# EAGLE design RECEIVER (EAGLE 7.5.0)
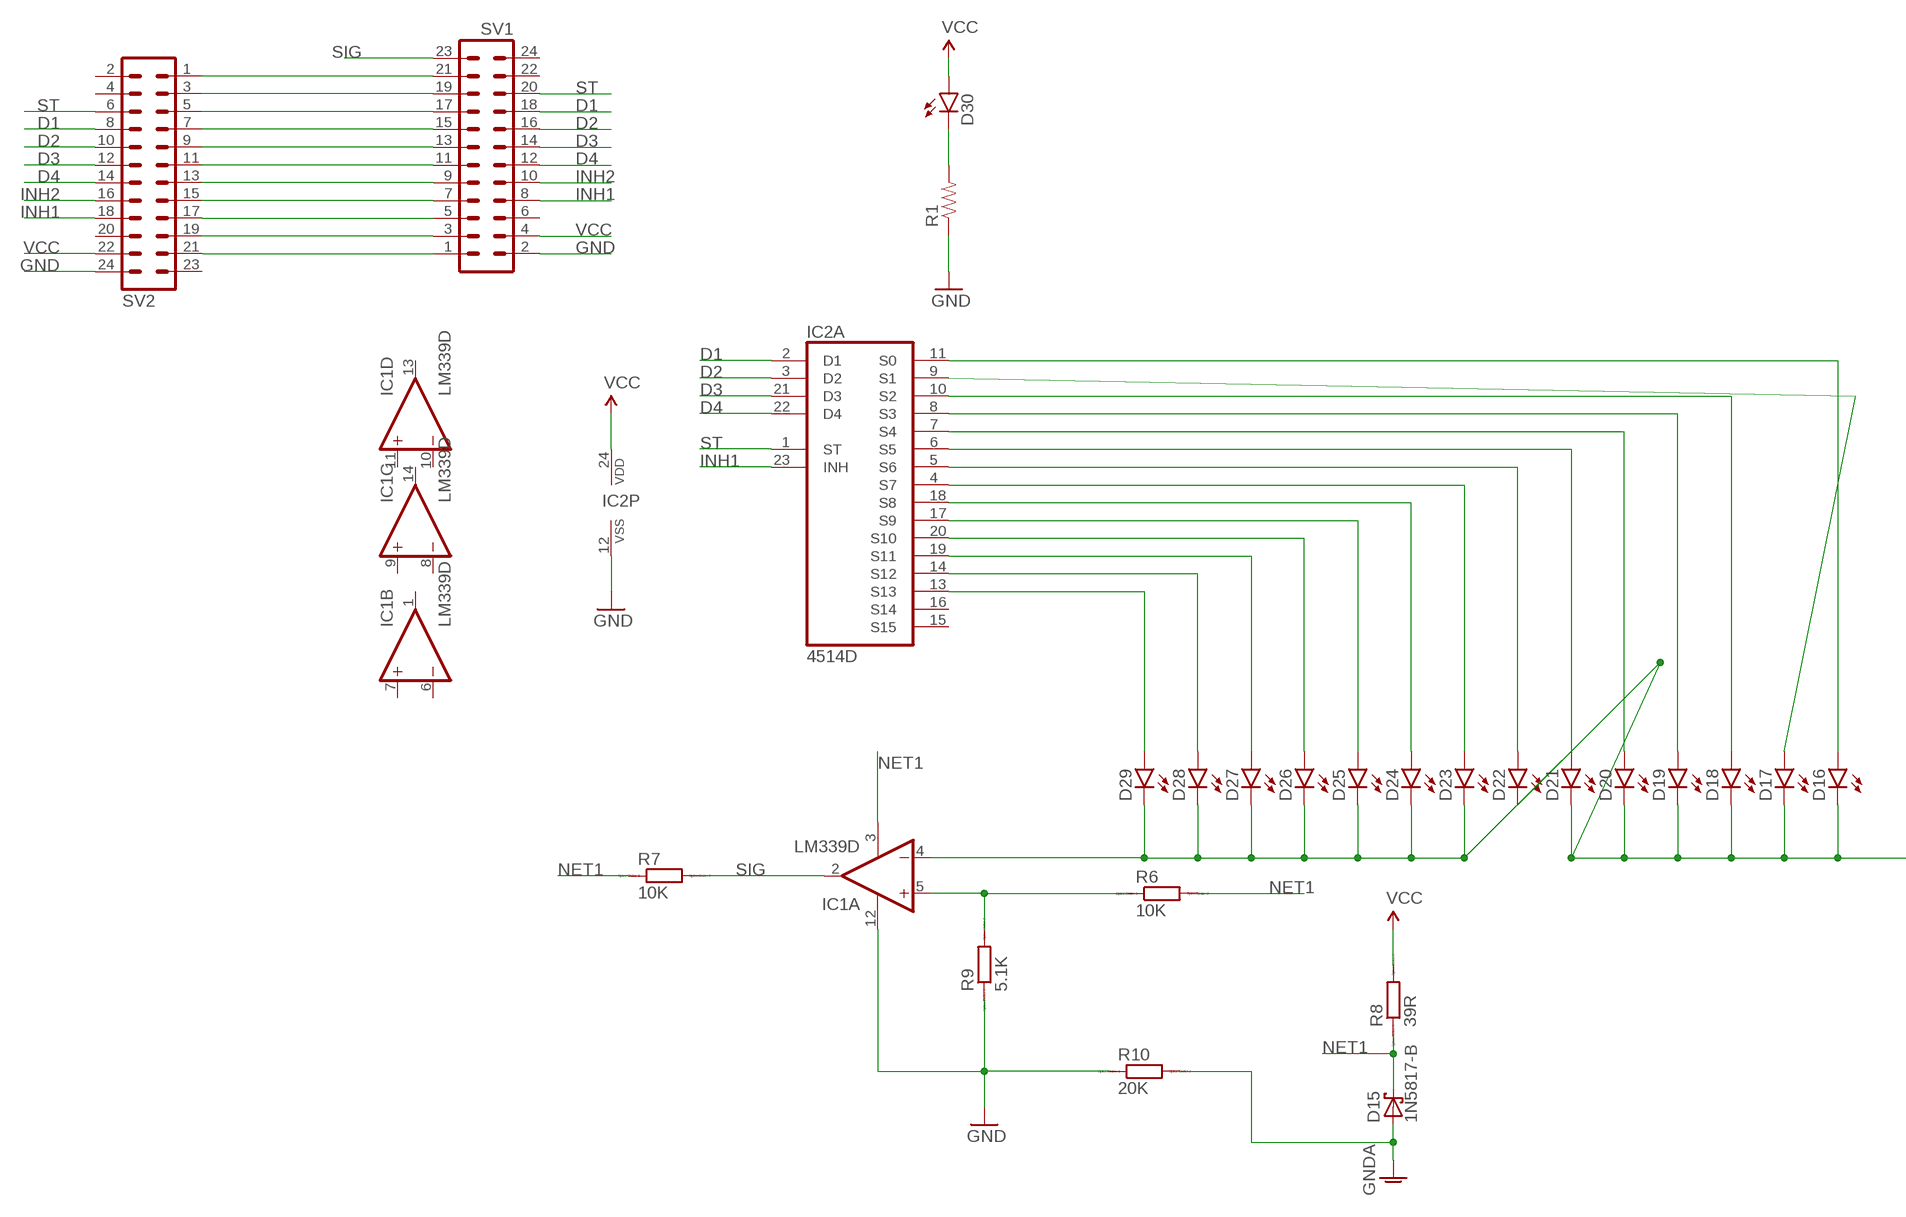
[diagram p0: schematic, sheet 1, part 1 of 2]
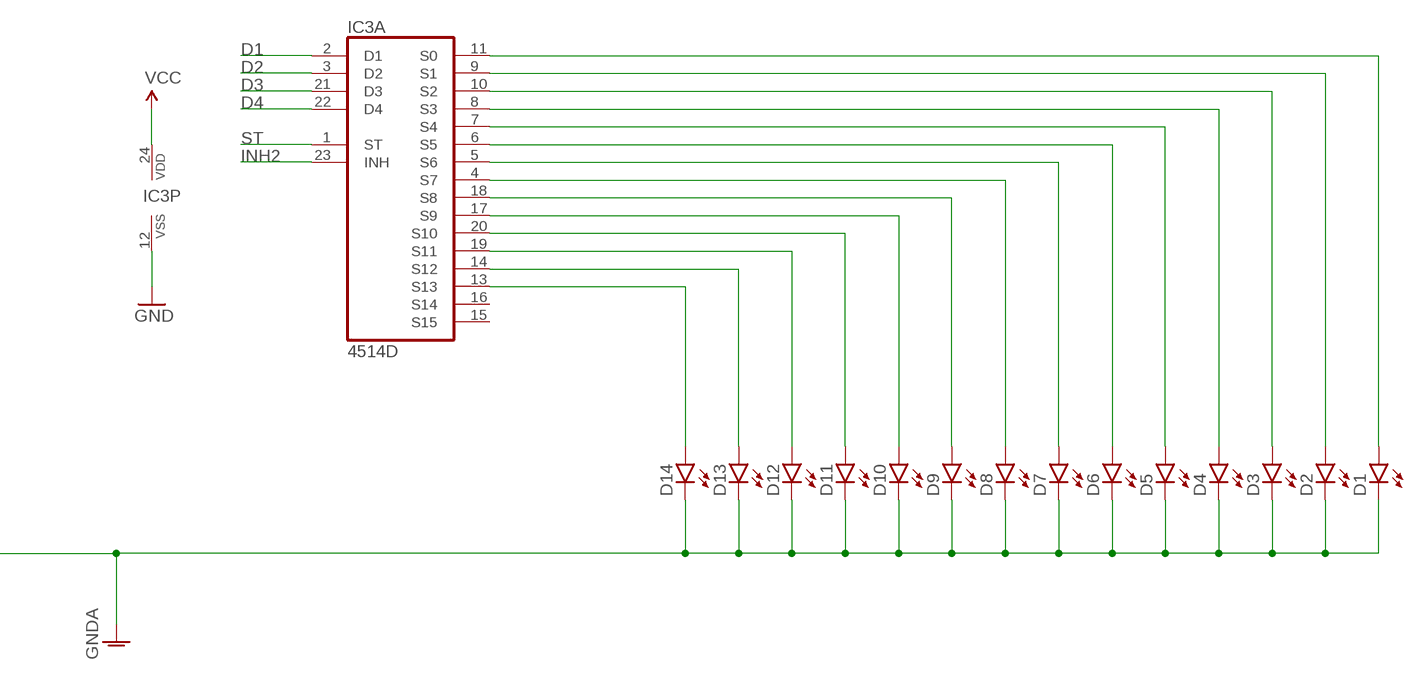
[diagram p1: schematic, sheet 1, part 2 of 2]

## Parts
D1  LED5MM  [LED5MM]
D2  LED5MM  [LED5MM]
D3  LED5MM  [LED5MM]
D4  LED5MM  [LED5MM]
D5  LED5MM  [LED5MM]
D6  LED5MM  [LED5MM]
D7  LED5MM  [LED5MM]
D8  LED5MM  [LED5MM]
D9  LED5MM  [LED5MM]
D10  LED5MM  [LED5MM]
D11  LED5MM  [LED5MM]
D12  LED5MM  [LED5MM]
D13  LED5MM  [LED5MM]
D14  LED5MM  [LED5MM]
D15  1N5817-B  [DO41-7.6]
D16  LED5MM  [LED5MM]
D17  LED5MM  [LED5MM]
D18  LED5MM  [LED5MM]
D19  LED5MM  [LED5MM]
D20  LED5MM  [LED5MM]
D21  LED5MM  [LED5MM]
D22  LED5MM  [LED5MM]
D23  LED5MM  [LED5MM]
D24  LED5MM  [LED5MM]
D25  LED5MM  [LED5MM]
D26  LED5MM  [LED5MM]
D27  LED5MM  [LED5MM]
D28  LED5MM  [LED5MM]
D29  LED5MM  [LED5MM]
D30  LED1206  [LED-1206]
IC1  LM339D  [SO14]
IC2  4514D  [SO24W]
IC3  4514D  [SO24W]
R1  RESISTOR1206  [1206]
R6  10K  R0207/10  [0207/10]
R7  10K  R0207/10  [0207/10]
R8  39R  R0207/10  [0207/10]
R9  5.1K  R0207/10  [0207/10]
R10  20K  R0207/10  [0207/10]
SV1  MA12-2W  [MA12-2W]
SV2  MA12-2W  [MA12-2W]

## Nets
D1: IC2.2(A:D1) IC3.2(A:D1) SV1.18 SV2.8
D2: IC2.3(A:D2) IC3.3(A:D2) SV1.16 SV2.10
D3: IC2.21(A:D3) IC3.21(A:D3) SV1.14 SV2.12
D4: IC2.22(A:D4) IC3.22(A:D4) SV1.12 SV2.14
GND: IC1.12(P:GND) IC2.12(P:VSS) IC3.12(P:VSS) R1.1 R9.1 R10.1 SV1.2 SV2.24
GNDA: D1.K(C) D2.K(C) D3.K(C) D4.K(C) D5.K(C) D6.K(C) D7.K(C) D8.K(C) D9.K(C) D10.K(C) D11.K(C) D12.K(C) D13.K(C) D14.K(C) D15.A D16.K(C) D17.K(C) D18.K(C) D19.K(C) D20.K(C) D21.K(C) D22.K(C) D23.K(C) D24.K(C) D25.K(C) D26.K(C) D27.K(C) D28.K(C) D29.K(C) IC1.4(A:-IN) R10.2
INH1: IC2.23(A:INH) SV1.8 SV2.18
INH2: IC3.23(A:INH) SV1.10 SV2.16
N$1: D16.A IC2.11(A:S0)
N$2: D17.A IC2.9(A:S1)
N$3: D18.A IC2.10(A:S2)
N$4: D19.A IC2.8(A:S3)
N$5: D20.A IC2.7(A:S4)
N$6: D21.A IC2.6(A:S5)
N$7: D22.A IC2.5(A:S6)
N$8: D23.A IC2.4(A:S7)
N$9: D24.A IC2.18(A:S8)
N$10: D25.A IC2.17(A:S9)
N$11: D26.A IC2.20(A:S10)
N$12: D27.A IC2.19(A:S11)
N$13: D28.A IC2.14(A:S12)
N$14: D29.A IC2.13(A:S13)
N$15: SV1.7 SV2.15
N$16: IC1.5(A:+IN) R6.1 R9.2
N$17: SV1.21 SV2.1
N$18: SV1.19 SV2.3
N$19: SV1.17 SV2.5
N$20: SV1.15 SV2.7
N$21: SV1.13 SV2.9
N$22: SV1.11 SV2.11
N$23: SV1.9 SV2.13
N$24: D1.A IC3.11(A:S0)
N$25: D2.A IC3.9(A:S1)
N$26: D3.A IC3.10(A:S2)
N$27: D4.A IC3.8(A:S3)
N$28: D5.A IC3.7(A:S4)
N$29: D6.A IC3.6(A:S5)
N$30: D7.A IC3.5(A:S6)
N$31: D8.A IC3.4(A:S7)
N$32: D9.A IC3.18(A:S8)
N$33: D10.A IC3.17(A:S9)
N$34: D11.A IC3.20(A:S10)
N$35: D12.A IC3.19(A:S11)
N$36: D13.A IC3.14(A:S12)
N$37: D14.A IC3.13(A:S13)
N$38: SV1.5 SV2.17
N$39: SV1.3 SV2.19
N$40: SV1.1 SV2.21
N$41: D30.C R1.2
NET1: D15.C IC1.3(P:V+) R6.2 R7.1 R8.1
SIG: IC1.2(A:OUT) R7.2 SV1.23
ST: IC2.1(A:ST) IC3.1(A:ST) SV1.20 SV2.6
VCC: D30.A IC2.24(P:VDD) IC3.24(P:VDD) R8.2 SV1.4 SV2.22
Unconnected: IC1.1(B:OUT) IC1.6(B:-IN) IC1.7(B:+IN) IC1.8(C:-IN) IC1.9(C:+IN) IC1.10(D:-IN) IC1.11(D:+IN) IC1.13(D:OUT) IC1.14(C:OUT) IC2.15(A:S15) IC2.16(A:S14) IC3.15(A:S15) IC3.16(A:S14) SV1.6 SV1.22 SV1.24 SV2.2 SV2.4 SV2.20 SV2.23

## Library data of the parts
D1-D14 D16-D30 = SparkFun-LED:LED: LEDs Standard schematic elements and footprints for 5mm, 3mm, 1206, and 0603 sized LEDs. 5mm - Spark Fun Electronics SKU : COM-00529 (and others)
D15 = diode:1N581*: 1.0A SCHOTTKY BARRIER RECTIFIER Source: http://www.diodes.com/datasheets/ds23001.pdf
IC1 = linear:LM339: Low Power Low Offset Voltage Quad Comparators with open collector; LM139/LM239/LM339/LM2901/LM3302
IC2 IC3 = 45xx:4514: 4-bit latch 4-16 line DECODER
R1 = SparkFun-Passives:RESISTOR: Resistor Basic schematic elements and footprints for 0603, 1206, and PTH resistors.
R6-R10 = eagle-ltspice:R: RESISTOR, European symbol; SPICEMODEL: NONE; SPICEPREFIX: R
SV1 SV2 = con-lstb:MA12-2W: PIN HEADER; OC_FARNELL: unknown; OC_NEWARK: unknown

## Board
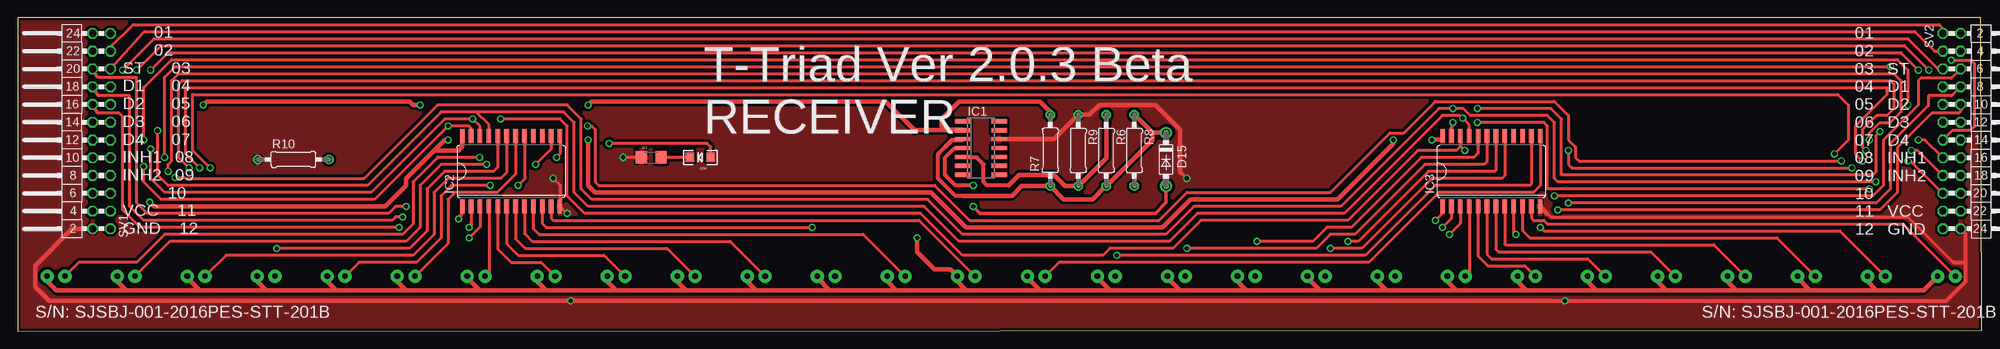
[diagram p2: board, top side]
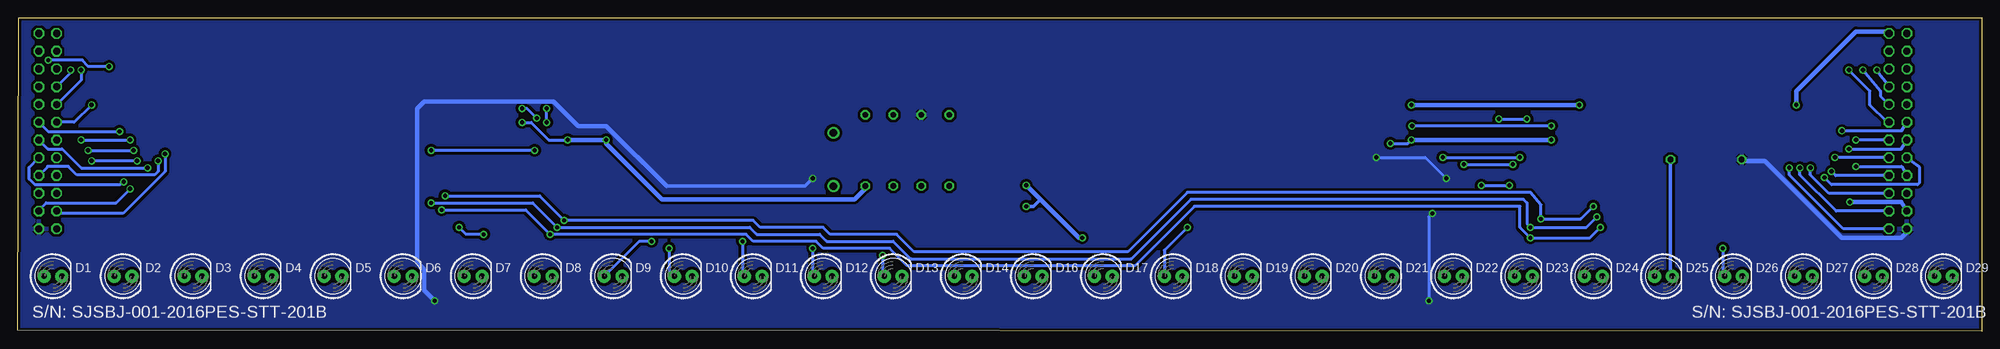
[diagram p3: board, bottom side, seen from below]

Size 280.57 x 44.85 mm. Coordinates in mm from the lower left corner, seen from the top.
Outline: 0.05,0 280.57,0.1 280.42,44.85 0,44.85 0.05,0
Copper layers (1*16): Top 0.035mm / dielectric 1.5mm / Bottom 0.035mm
Design rules "default": minimum track width 5mil, minimum drill 15mil, track to track 7mil, track to pad 7mil, pad to pad 7mil, via to via 7mil, smd to smd 6mil, copper to edge 15mil, drill to drill 8mil, minimum pad ring 10mil, minimum via ring 8mil, stop-mask expansion 4mil, vias tented up to drill 0mil, thermal gap 10mil

### Footprints (pad centres in the part's own frame; a part is rotated, then mirrored left to right if it is on the bottom)
LED5MM = drill 0.813 pad 1.88: A -1.27,0; K 1.27,0
DO41-7.6 = drill 1.1 pad 1.7: A 3.81,0; C -3.81,0
LED-1206 = smd 1.2 x 1.4: A -1.5,0; C 1.5,0
SO14 = smd 0.6 x 2.2: 1 -3.81,-2.6; 2 -2.54,-2.6; 3 -1.27,-2.6; 4 0,-2.6; 5 1.27,-2.6; 6 2.54,-2.6; 7 3.81,-2.6; 8 3.81,2.6; 9 2.54,2.6; 10 1.27,2.6; 11 0,2.6; 12 -1.27,2.6; 13 -2.54,2.6; 14 -3.81,2.6
SO24W = smd 0.66 x 2.032: 1 -6.985,-5.029; 2 -5.715,-5.029; 3 -4.445,-5.029; 4 -3.175,-5.029; 5 -1.905,-5.029; 6 -0.635,-5.029; 7 0.635,-5.029; 8 1.905,-5.029; 9 3.175,-5.029; 10 4.445,-5.029; 11 5.715,-5.029; 12 6.985,-5.029; 13 6.985,5.029; 14 5.715,5.029; 15 4.445,5.029; 16 3.175,5.029; 17 1.905,5.029; 18 0.635,5.029; 19 -0.635,5.029; 20 -1.905,5.029; 21 -3.175,5.029; 22 -4.445,5.029; 23 -5.715,5.029; 24 -6.985,5.029
1206 = smd 1.6 x 1.8: 1 -1.4,0; 2 1.4,0
0207/10 = drill 0.813 octagon: 1 -5.08,0; 2 5.08,0
MA12-2W = drill 1.016 octagon: 1 -13.97,-1.27; 2 -13.97,1.27; 3 -11.43,-1.27; 4 -11.43,1.27; 5 -8.89,-1.27; 6 -8.89,1.27; 7 -6.35,-1.27; 8 -6.35,1.27; 9 -3.81,-1.27; 10 -3.81,1.27; 11 -1.27,-1.27; 12 -1.27,1.27; 13 1.27,-1.27; 14 1.27,1.27; 15 3.81,-1.27; 16 3.81,1.27; 17 6.35,-1.27; 18 6.35,1.27; 19 8.89,-1.27; 20 8.89,1.27; 21 11.43,-1.27; 22 11.43,1.27; 23 13.97,-1.27; 24 13.97,1.27

### Placement (x,y rotation side)
D1  275.5,7.85 0 bottom
D2  265.5,7.85 0 bottom
D3  255.5,7.85 0 bottom
D4  245.5,7.85 0 bottom
D5  235.5,7.85 0 bottom
D6  225.5,7.85 0 bottom
D7  215.5,7.85 0 bottom
D8  205.5,7.85 0 bottom
D9  195.5,7.85 0 bottom
D10  185.5,7.85 0 bottom
D11  175.5,7.85 0 bottom
D12  165.5,7.85 0 bottom
D13  155.5,7.85 0 bottom
D14  145.5,7.85 0 bottom
D15  164.05,24.55 270 top
D16  135.5,7.85 0 bottom
D17  125.5,7.85 0 bottom
D18  115.5,7.85 0 bottom
D19  105.5,7.85 0 bottom
D20  95.5,7.85 0 bottom
D21  85.5,7.85 0 bottom
D22  75.5,7.85 0 bottom
D23  65.5,7.85 0 bottom
D24  55.5,7.85 0 bottom
D25  45.5,7.85 0 bottom
D26  35.5,7.85 0 bottom
D27  25.5,7.85 0 bottom
D28  15.5,7.85 0 bottom
D29  5.5,7.85 0 bottom
D30  97.5,24.85 180 top
IC1  137.61,26.18 270 top
IC2  70.5,22.85 0 top
IC3  210.5,22.85 0 top
R1  90.5,24.85 0 top
R6  155.5,25.85 270 top
R7  147.5,25.85 90 top
R8  159.5,25.85 270 top
R9  151.5,25.85 270 top
R10  39.4,24.55 0 top
SV1  12,28.6 90 top
SV2  276.25,28.6 270 top

### Tracks (layer width: path | path; a pad name or v marks a point on that pad's centre or on a via)
D1  (via drill 0.6)
  Top 0.406: IC2.2 64.78,15.13 v64.5,14.85 | v55,16.35 54,16.35 53.5,15.85 18,15.85 16,17.85 16,33.65 11.53,33.65 SV1.18 | IC3.2 204.78,16.14 v203.5,14.85 | SV2.8 276.22,33.65 272.9,33.65 272.9,32.25 267.5,26.85 267.5,20.35 265.5,18.35 v221.5,18.35
  Bottom 0.406: v55,16.35 56.5,14.85 v64.5,14.85 65,15.35 65,18.35 65.5,18.85 113,18.85 121.5,10.35 153,10.35 155.5,12.85 165,12.85 166,13.85 175,13.85 176,14.85 v203.5,14.85 207,18.35 v221.5,18.35
D2  (via drill 0.6)
  Top 0.406: IC2.3 66.06,14.9 v64.5,13.35 | v54.5,14.85 17.5,14.85 15,17.35 15,30.65 14.5,31.15 11.49,31.15 SV1.16 | IC3.3 206.06,15.4 v204.5,13.85 | SV2.10 277.52,31.47 277.2,31.15 273.4,31.15 268.5,26.25 268.5,19.85 266,17.35 v220,17.35
  Bottom 0.406: v54.5,14.85 56,13.35 v64.5,13.35 66,14.85 66,17.85 112.5,17.85 121,9.35 153.5,9.35 156,11.85 165.5,11.85 166.5,12.85 175.5,12.85 176.5,13.85 v204.5,13.85 208,17.35 v220,17.35
D3  (via drill 0.6)
  Top 0.406: IC2.21 67.33,29.53 65.5,31.35 | 65.5,31.35 60.5,31.35 50,20.85 21.5,20.85 20,22.35 v20,28.65 | IC3.21 207.32,29.53 v206.4,30.45 206,30.85 203.5,30.85 189.5,16.85 168.5,16.85 164.5,12.85 134.5,12.85 129.5,17.85 81.5,17.85 79.5,19.85 79.5,29.85 78,31.35 65.5,31.35 | v208.5,31.85 219,31.85 220.5,30.35 220.5,22.35 265,22.35 265.5,22.85 265.5,28.05 v266,28.55
  Bottom 0.406: v20,28.65 11.45,28.65 SV1.14 | SV2.12 276.2,28.55 v266,28.55 | v206.4,30.45 207.8,31.85 v208.5,31.85
D4  (via drill 0.6)
  Top 0.406: IC2.22 66.06,29.3 v65,30.35 61,30.35 50.5,19.85 21,19.85 19,21.85 v19,26.05 | v69,30.35 77.5,30.35 78.5,29.35 78.5,19.35 81,16.85 129,16.85 135,10.85 155,10.85 156,11.85 165,11.85 169,15.85 190,15.85 200,25.85 205.5,25.85 206.06,26.41 IC3.22 206.06,26.5 v206.7,25.85 | v221.5,25.85 221.5,23.85 222,23.35 v262,23.35
  Bottom 0.406: v19,26.05 11.51,26.05 SV1.12 | v69,30.35 v65,30.35 | v206.7,25.85 v221.5,25.85 | SV2.14 276.24,26.05 274.2,26.05 271.5,23.35 v262,23.35
GND  (via drill 0.6)
  Top 0.406: 218.46,16.85 218.5,16.85 219,16.35 270,16.35 276.5,9.85 | 278.25,7.1 276,4.85 | v78.5,16.85 78.46,16.85 IC2.12 77.48,20.87 v76.5,21.85 | R1.1 v86.5,24.85
  Top 0.5: v167,21.85 166,22.85
  Top 0.6: 219,4.35 275.5,4.35 278.25,7.1 278.25,9.85 | 278.25,9.85 278.25,13.9 SV2.24 | 276.5,9.85 278.25,9.85
  Top 0.61: SV1.2 7.78,14.63 2.5,9.35 2.5,6.35 4.5,4.35 v79,4.35 219,4.35 | 218.46,16.85 IC3.12 | 166,22.69 166,22.85 166,28.85 162.5,32.35 154.5,32.35 153.08,30.93 R9.1 148.02,27.45 IC1.12
  Bottom 0.406: v78.5,16.85 79,16.35 v79,4.35 | v86.5,24.85 79.5,24.85 v76.5,21.85
  Bottom 0.5: 187.89,20.74 168.11,20.74 v167,21.85
  Bottom 0.61: SV1.2 10.23,14.62 11.5,13.35 20,13.35 31,24.35 34.12,24.35 R10.1 | 187.89,20.74 196.5,29.35 200.5,29.35 204,32.85 222.5,32.85 223.5,31.85 223.5,9.85 222.5,8.85 222.5,5.85 v221,4.35
  pour Top (isolate 0.406): 0,44.85 280.5,44.85 280.5,-0.15 0,-0.15
  pour Bottom (isolate 0.406): 0,-0.15 280.5,-0.15 280.5,44.85 0,44.85
GNDA  (via drill 0.6)
  Top 0.5: D15.A 164.05,18.4 162.5,16.85 137.5,16.85 v136.5,17.85
  Top 0.6: v136.5,20.85 134,20.85 132.5,22.35 132.5,24.85 133.83,26.18 IC1.4
  Top 0.61: D29.K 4.23,7.12 5.5,5.85 15.5,5.85 | 15.5,5.85 26,5.85 | 26,5.85 35.5,5.85 | 35.5,5.85 45.5,5.85 | 45.5,5.85 55.5,5.85 | 55.5,5.85 66,5.85 | 66,5.85 75.5,5.85 | 75.5,5.85 85.5,5.85 | 85.5,5.85 95.5,5.85 | 95.5,5.85 105.5,5.85 | 105.5,5.85 116,5.85 | 116,5.85 125.5,5.85 | 125.5,5.85 135.5,5.85 | 135.5,5.85 146,5.85 | 146,5.85 156,5.85 | 156,5.85 166,5.85 | 166,5.85 175.5,5.85 | 175.5,5.85 186,5.85 | 186,5.85 195.5,5.85 | 195.5,5.85 205.5,5.85 | 205.5,5.85 215.5,5.85 | 215.5,5.85 225.5,5.85 | 225.5,5.85 235.5,5.85 | 235.5,5.85 245.5,5.85 | 245.5,5.85 256,5.85 | 256,5.85 265.5,5.85 | 265.5,5.85 272.23,5.85 D1.K | D2.K 264.23,7.12 265.5,5.85 | D3.K 254.23,7.62 256,5.85 | D4.K 244.23,7.12 245.5,5.85 | D5.K 234.23,7.12 235.5,5.85 | D6.K 224.23,7.12 225.5,5.85 | D7.K 214.23,7.12 215.5,5.85 | D8.K 204.23,7.12 205.5,5.85 | D9.K 194.23,7.12 195.5,5.85 | D10.K 184.23,7.62 186,5.85 | D11.K 174.23,7.12 175.5,5.85 | D12.K 164.23,7.62 166,5.85 | D13.K 154.23,7.62 156,5.85 | D14.K 144.23,7.62 146,5.85 | 135.5,5.85 134.23,7.12 D16.K 133.23,8.85 131,8.85 128.5,11.35 v128.5,13.35 | D17.K 124.23,7.12 125.5,5.85 | D18.K 114.23,7.62 116,5.85 | D19.K 104.23,7.12 105.5,5.85 | D20.K 94.23,7.12 95.5,5.85 | D21.K 84.23,7.12 85.5,5.85 | D22.K 74.23,7.12 75.5,5.85 | D23.K 64.23,7.62 66,5.85 | D24.K 54.23,7.12 55.5,5.85 | D25.K 44.23,7.12 45.5,5.85 | D26.K 34.23,7.12 35.5,5.85 | D27.K 24.23,7.62 26,5.85 | D28.K 14.23,7.12 15.5,5.85
  Bottom 0.5: v136.5,17.85 135.5,17.85 134.5,18.85 | R10.2 44.48,8.37
  Bottom 0.61: 44.48,8.37 44.5,8.35 44.5,8.12 D25.K | v136.5,20.85 134.5,18.85 129,13.35 v128.5,13.35
INH1  (via drill 0.6)
  Top 0.406: 64.4,29.35 64.5,29.35 64.78,29.07 IC2.23 64.78,28.96 64.4,29.35 | v18,23.55 18,21.35 20.5,18.85 51,18.85 v61.5,29.35 64.4,29.35 | v81.4,29.35 82,29.35 82.5,28.85 82.5,21.35 83,20.85 131,20.85 136,15.85 163,15.85 167,19.85 187.5,19.85 196,28.35 198,28.35 202.5,32.85 219.5,32.85 221.5,30.85 221.5,27.35 222.5,26.35 222.5,24.85 223,24.35 v260.5,24.35
  Bottom 0.406: v18,23.55 11.47,23.55 SV1.8 | v61.5,29.35 v81.4,29.35 | v260.5,24.35 260.5,22.85 261,22.35 272.1,22.35 273.3,23.55 276.28,23.55 276.28,23.49 SV2.18
INH2  (via drill 0.6)
  Top 0.406: v22.5,21.95 23.9,21.95 24,21.85 49.5,21.85 60,32.35 78.5,32.35 80.5,30.35 80.5,20.35 82,18.85 130,18.85 135,13.85 164,13.85 168,17.85 189,17.85 203,31.85 v205,31.85 206.5,31.85 207.5,30.85 218.5,30.85 219.5,29.85 219.5,21.85 220,21.35 v265.4,21.35 | IC3.23 204.78,29.14 205,29.35 v205,29.85
  Bottom 0.406: v22.5,21.95 21.5,20.95 9.2,20.95 8.9,21.25 8.9,23.46 SV1.10 | v205,29.85 v205,31.85 | v265.4,21.35 266,20.95 278.1,20.95 278.9,21.75 278.9,23.41 SV2.16
N$1
  Top 0.406: IC2.11 76.22,16.14 76.5,15.85 128.77,15.85 D16.A
N$2
  Top 0.406: IC2.9 73.67,14.67 74.5,13.85 120.77,13.85 D17.A
N$3  (via drill 0.6)
  Top 0.406: IC2.10 74.94,15.4 75.5,14.85 v113.5,14.85
  Bottom 0.406: v113.5,14.85 116.77,11.58 D18.A
N$4
  Top 0.406: IC2.8 72.41,13.95 73.5,12.85 101.77,12.85 D19.A
N$5
  Top 0.406: IC2.7 71.14,13.21 72.5,11.85 92.77,11.85 D20.A
N$6
  Top 0.406: IC2.6 69.86,12.48 71.5,10.85 83.77,10.85 D21.A
N$7
  Top 0.406: IC2.5 68.59,11.75 70.5,9.85 74.77,9.85 D22.A
N$8
  Top 0.406: IC2.4 67.33,8.4 D23.A
N$9
  Top 0.406: IC2.18 71.14,22.49 68.5,19.85 62.5,19.85 61.5,18.85 61.5,12.58 D24.A
N$10  (via drill 0.6)
  Top 0.406: IC2.17 72.41,21.76 v71.5,20.85 | v67.5,20.85 62,20.85 60.5,19.35 60.5,13.35 57,9.85 48.77,9.85 D25.A
  Bottom 0.406: v71.5,20.85 v67.5,20.85
N$11  (via drill 0.6)
  Top 0.406: IC2.20 68.59,23.45 68,22.85 61,22.85 58.5,20.35 58.5,14.35 56,11.85 v37,11.85
  Bottom 0.406: v37,11.85 37,8.08 D26.A
N$12
  Top 0.406: IC2.19 69.86,22.71 69,21.85 61.5,21.85 59.5,19.85 59.5,13.85 56.5,10.85 29.77,10.85 D27.A
N$13  (via drill 0.6)
  Top 0.406: IC2.14 76.22,26.07 v74,23.85 | v67,23.85 60.5,23.85 57.5,20.85 57.5,14.85 55.5,12.85 21.77,12.85 D28.A
  Bottom 0.406: v74,23.85 v67,23.85
N$14  (via drill 0.6)
  Top 0.406: IC2.13 77.48,25.34 v77,24.85 | v66,24.85 60,24.85 56.5,21.35 56.5,15.35 55,13.85 21,13.85 17,9.85 8.77,9.85 D29.A
  Bottom 0.406: v77,24.85 v66,24.85
N$15  (via drill 0.6)
  Top 0.406: v21.5,22.85 21.5,23.85 22,24.35 22,35.85 23,36.85 268,36.85 269,35.85 269,31.35 267.5,29.85 266,29.85 264.5,28.35 v264.5,27.35 | SV2.15 272.42,27.35 v271.5,27.35
  Bottom 0.406: SV1.7 20.9,22.25 v21.5,22.85 | v271.5,27.35 v264.5,27.35
N$16
  Top 0.6: 141.5,20.85 138.5,20.85 138,21.35 138,23.85 137,24.85 135.07,24.85 IC1.5
  Top 0.61: R6.1 155.5,24.77 R9.2 149.58,20.77 148,22.35 143,22.35 141.5,20.85
N$17
  Top 0.406: SV1.21 13.27,40.62 16.5,43.85 274.5,43.85 275.5,42.85 275.26,42.85 SV2.1
N$18
  Top 0.406: SV1.19 18.13,42.85 271,42.85 273.82,40.03 SV2.3
N$19  (via drill 0.6)
  Top 0.406: v15,37.35 19.5,41.85 270,41.85 274.36,37.49 SV2.5
  Bottom 0.406: SV1.17 15,37.18 v15,37.35
N$20  (via drill 0.6)
  Top 0.406: v17,37.35 20.5,40.85 269.5,40.85 v273,37.35
  Bottom 0.406: v17,37.35 14.5,34.35 14.5,33.64 SV1.15 | v273,37.35 273,36.93 SV2.7
N$21  (via drill 0.6)
  Top 0.406: v19,37.35 21.5,39.85 269,39.85 v271.5,37.35
  Bottom 0.406: SV1.13 13.52,29.87 16,32.35 16,34.35 v19,37.35 | v271.5,37.35 271.5,35.89 SV2.9
N$22  (via drill 0.6)
  Top 0.406: v18,27.35 18,34.85 22,38.85 268.5,38.85 270,37.35 v270,32.35
  Bottom 0.406: SV1.11 17.98,27.33 v18,27.35 | v270,32.35 272.48,29.87 SV2.11
N$23  (via drill 0.6)
  Top 0.406: v21,24.85 21,36.35 22.5,37.85 v267.5,37.85 | v276.2,38.75 279,38.75 279.5,38.25 279.5,29.25 278.9,28.65 276.3,28.65 SV2.13
  Bottom 0.406: SV1.9 12.83,24.85 v21,24.85 | v267.5,37.85 270.5,37.85 271.3,38.75 v276.2,38.75
N$24
  Top 0.406: IC3.11 216.22,16.14 216.5,15.85 218,15.85 218.5,15.35 269.27,15.35 D1.A
N$25  (via drill 0.6)
  Top 0.406: IC3.9 213.68,14.17 v214,13.85 | v217.5,14.85 218,14.35 260.27,14.35 D2.A
  Bottom 0.406: v214,13.85 216.5,13.85 v217.5,14.85
N$26
  Top 0.406: IC3.10 214.94,14.4 216,13.35 251.27,13.35 D3.A
N$27
  Top 0.406: IC3.8 212.41,12.45 212.5,12.35 242.27,12.35 D4.A
N$28
  Top 0.406: IC3.7 211.13,11.71 211.5,11.35 233.27,11.35 D5.A
N$29
  Top 0.406: IC3.6 209.87,10.98 210.5,10.35 224.27,10.35 D6.A
N$30
  Top 0.406: IC3.5 208.59,10.75 210,9.35 215.27,9.35 D7.A
N$31
  Top 0.406: IC3.4 207.32,8.4 D8.A
N$32  (via drill 0.6)
  Top 0.406: IC3.18 211.13,22.99 211,22.85 201.5,22.85 191.5,12.85 v190,12.85
  Bottom 0.406: v190,12.85 191.77,12.85 D9.A
N$33  (via drill 0.6)
  Top 0.406: IC3.17 212.41,22.26 212,21.85 202,21.85 192,11.85 v187.5,11.85
  Bottom 0.406: v187.5,11.85 187.5,8.58 D10.A
N$34  (via drill 0.6)
  Top 0.406: IC3.20 208.59,25.45 208,24.85 200.5,24.85 190.5,14.85 187,14.85 185,12.85 v177,12.85
  Bottom 0.406: v177,12.85 177,8.08 D11.A
N$35  (via drill 0.6)
  Top 0.406: IC3.19 209.87,24.21 209.5,23.85 201,23.85 191,13.85 187.5,13.85 185.5,11.85 v167,11.85
  Bottom 0.406: v167,11.85 167,8.08 D12.A
N$36  (via drill 0.6)
  Top 0.406: IC3.14 216.22,21.07 216,20.85 202.5,20.85 192.5,10.85 v157,10.85
  Bottom 0.406: v157,10.85 157,8.08 D13.A
N$37
  Top 0.406: IC3.13 217.49,20.84 216.5,19.85 203,19.85 193,9.85 148.77,9.85 D14.A
N$38  (via drill 0.6)
  Top 0.406: v24.5,23.35 23,24.85 23,35.35 23.5,35.85 267.5,35.85 268,35.35 268,31.85 267,30.85 265.5,30.85 263.5,28.85 263.5,26.35 v264,25.85 | SV2.17 271.38,25.85 v270.5,25.85
  Bottom 0.406: SV1.5 21.86,19.71 24.5,22.35 v24.5,23.35 | v270.5,25.85 v264,25.85
N$39  (via drill 0.6)
  Top 0.406: v26,23.35 24,25.35 24,34.85 267,34.85 267,33.85 262.5,29.35 262.5,25.35 v263.5,24.35 | v270,24.35 270.34,24.35 SV2.19
  Bottom 0.406: SV1.3 20.82,17.17 26,22.35 v26,23.35 | v263.5,24.35 v270,24.35
N$40  (via drill 0.6)
  Top 0.406: v27.5,23.35 25,25.85 25,33.85 260,33.85 261.5,32.35 261.5,27.35 v259.5,25.35
  Bottom 0.406: SV1.1 19.78,14.63 27.5,22.35 v27.5,23.35 | v259.5,25.35 259.5,22.85 265.5,16.85 274.66,16.85 SV2.21
N$41
  Top 0.406: D30.C R1.2
NET1
  Top 0.6: 135,19.35 134,19.35 131.5,21.85 131.5,25.35 132.5,26.35
  Top 0.61: D15.C 162.07,28.36 | 162.07,28.36 R8.1 | 162.07,28.36 162.07,27.34 R6.2 155.42,20.77 153.5,18.85 149.42,18.85 R7.1 143.42,20.77 142,19.35 135,19.35 | 132.5,26.35 133.5,27.35 134.91,27.35 IC1.3
SIG  (via drill 0.6)
  Top 0.61: R7.2 147.5,31.35 146,32.85 134.5,32.85 132,30.35 132,29.35 132.5,28.85 134.88,28.85 IC1.2 128.13,28.72 124,32.85 82,32.85 v81.5,32.35 | v57.5,32.35 56.5,32.35 56,32.85 27,32.85 v26.5,32.35
  Bottom 0.61: v81.5,32.35 v57.5,32.35 | v26.5,32.35 26.5,34.35 18,42.85 13.05,42.85 SV1.23
ST  (via drill 0.6)
  Top 0.406: IC2.1 63.52,16.87 v63,16.05 | v55.5,17.85 54,17.85 53,16.85 18.5,16.85 17,18.35 17,36.25 11.47,36.25 SV1.20 | IC3.1 203.51,16.87 v202.5,15.85 | SV2.6 276.18,36.15 271.8,36.15 271.5,35.85 271.5,32.35 266.5,27.35 266.5,20.85 265,19.35 v219.5,19.35
  Bottom 0.406: v55.5,17.85 57.3,16.05 v63,16.05 63,18.05 64.5,19.85 113.5,19.85 122,11.35 152.5,11.35 155,13.85 164.5,13.85 165.5,14.85 174.5,14.85 175.5,15.85 v202.5,15.85 206,19.35 v219.5,19.35
VCC  (via drill 0.6)
  Top 0.406: v264.5,20.35 218.5,20.35 218.5,29.35 218,29.85 v208.5,29.85 | D30.A 99,26.35 98.5,26.85 v84.5,26.85
  Top 0.61: IC2.24 63.52,26.37 63,25.85 59.5,25.85 | 59.5,25.85 55.5,21.85 55.5,20.85 52.5,17.85 19.5,17.85 v18.9,18.45 | IC3.24 203.51,27.37 202.01,27.37 v202,27.35 | v196.5,27.35 196.5,26.85 188.5,18.85 167.5,18.85 163.5,14.85 135.5,14.85 130.5,19.85 82.5,19.85 81.5,20.85 v81.5,27.35 | v61.5,27.35 61,27.35 59.5,25.85
  Bottom 0.406: SV2.22 277.52,17.33 276.5,18.35 266.5,18.35 v264.5,20.35 | v208.5,29.85 207.2,29.85 204.7,27.35 201.5,27.35 | v84.5,26.85 82,26.85 v81.5,27.35
  Bottom 0.61: v18.9,18.45 11.51,18.45 SV1.4 | v202,27.35 201.5,27.35 v196.5,27.35 196.5,26.85 188.5,18.85 161,18.85 159.5,20.35 R8.2 | v81.5,27.35 v61.5,27.35

### Text on the board
tNames: T-Triad Ver 2.0.3 Beta / RECEIVER | 01 / 02 / ST 03 / D1 04 / D2 05 / D3 06 / D4 07 / INH1 08 / INH2 09 / 10 / VCC 11 / GND 12 | 01 / 02 / 03 ST / 04 D1 / 05 D2 / 06 D3 / 07 D4 / 08 INH1 / 09 INH2 / 10 / 11 VCC / 12 GND | S/N: SJSBJ-001-2016PES-STT-201B | S/N: SJSBJ-001-2016PES-STT-201B
bNames: S/N: SJSBJ-001-2016PES-STT-201B | S/N: SJSBJ-001-2016PES-STT-201B